# EAGLE schematic edition4-mainpart (1) (EAGLE 9.6.2)
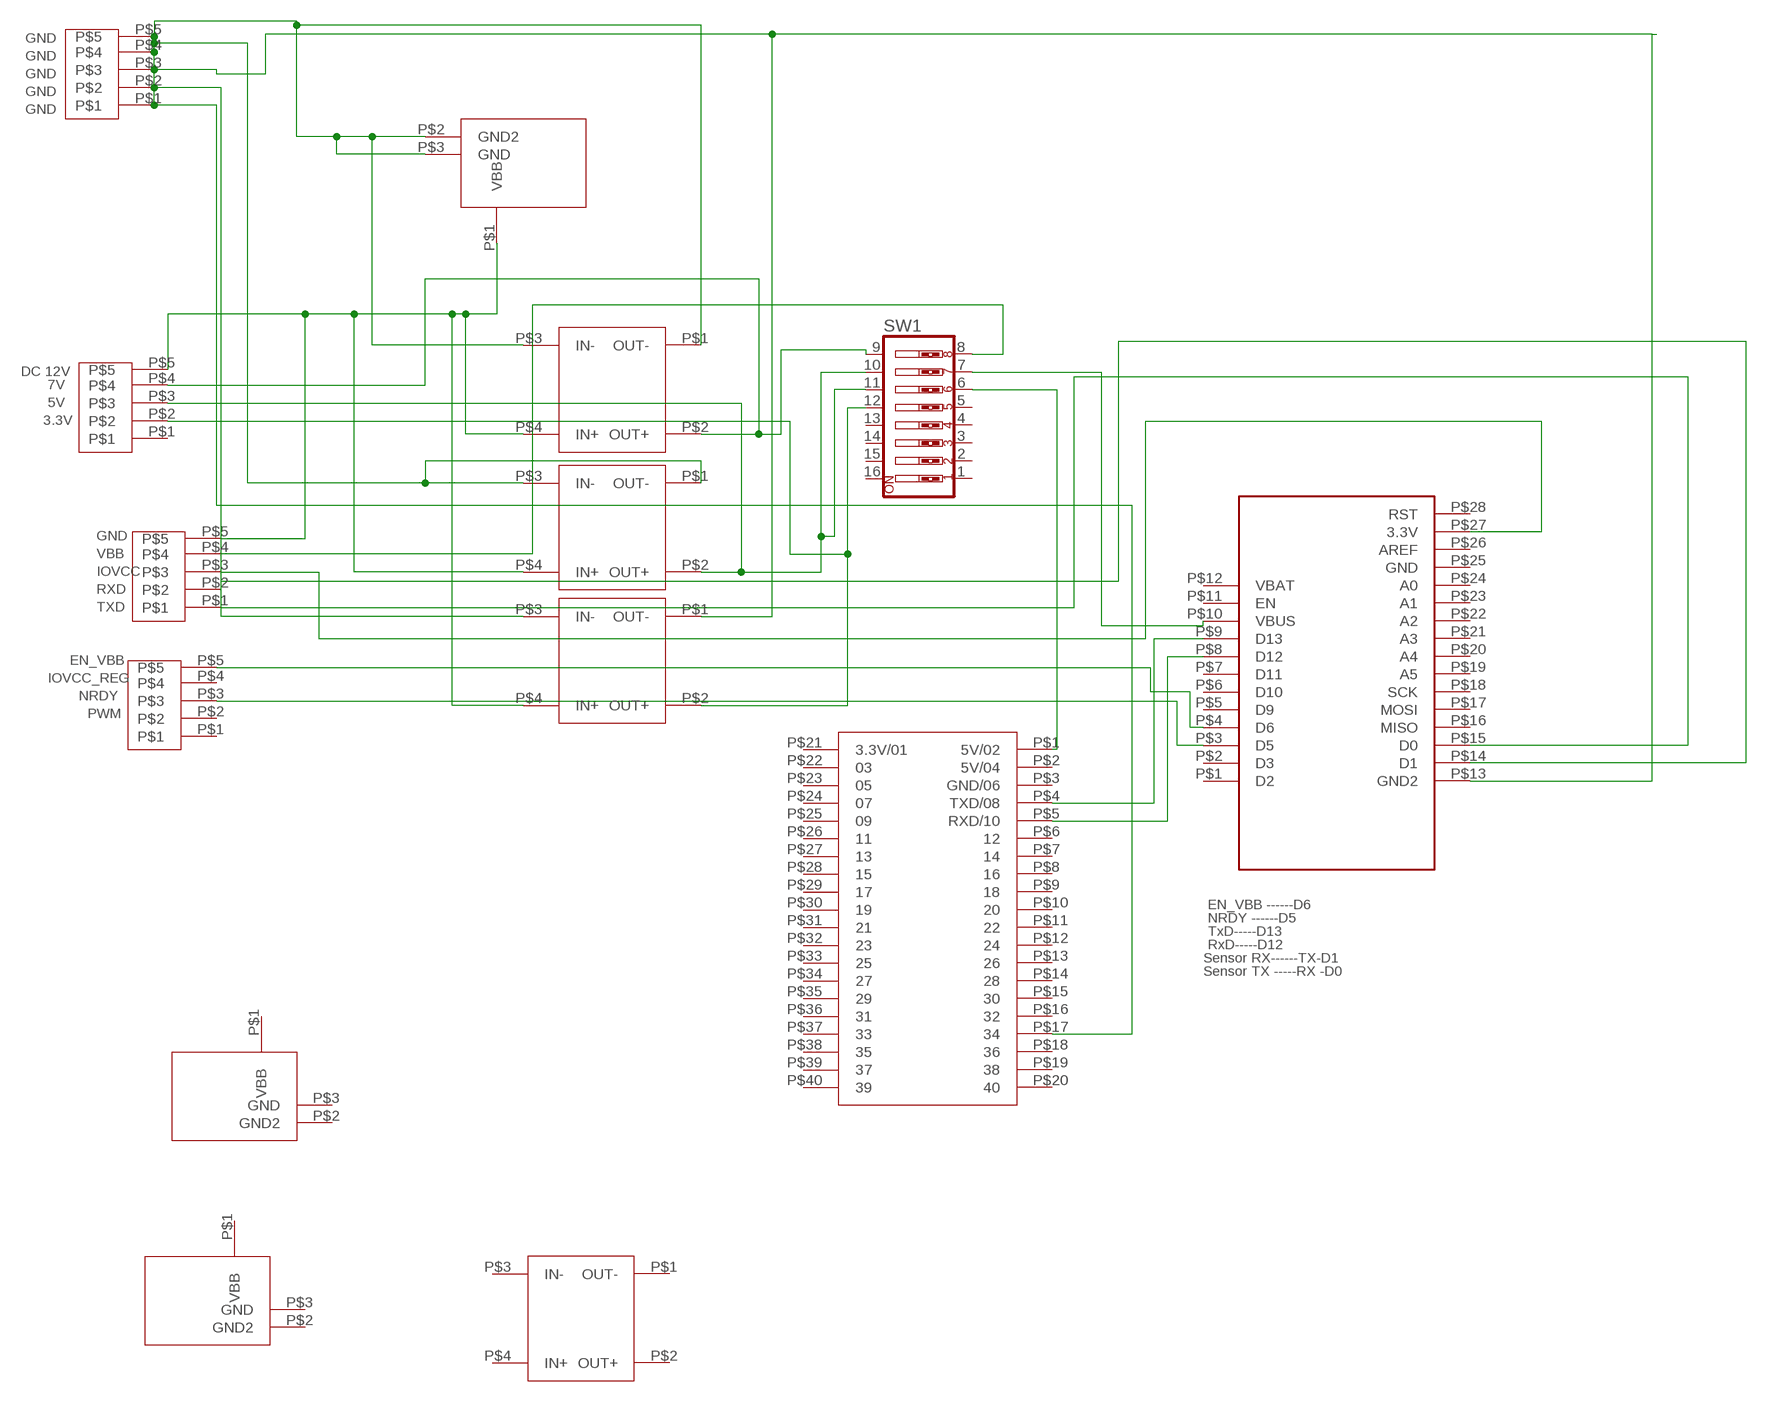
[diagram p0: schematic, sheet 1]

## Parts
SW1  SW_DIP-8  [EDG-08]
U$1  PIN  [PIN]
U$2  PIN  [PIN]
U$3  POWER  [POWERIN]
U$4  POWER  [POWERIN]
U$5  POWER  [POWERIN]
U$6  MH-MINI-360  [MH-MINI-360]
U$7  MH-MINI-360  [MH-MINI-360]
U$8  MH-MINI-360  [MH-MINI-360]
U$9  MH-MINI-360  [MH-MINI-360]
U$10  FEATHER  [FEATHER]
U$11  RASPBERRYPI  [RASPBERRYPI]
U$12  PIN  [PIN]
U$13  PIN  [PIN]

## Nets
N$1: U$3.P$2(GND2) U$3.P$3(GND) U$6.P$1(OUT-) U$6.P$3(IN-) U$8.P$1(OUT-) U$8.P$3(IN-) U$9.P$1(OUT-) U$9.P$3(IN-) U$10.P$13(GND2) U$11.P$17 U$13.P$1 U$13.P$2 U$13.P$3 U$13.P$4 U$13.P$5
N$2: SW1.7 U$10.P$10(VBUS)
N$3: SW1.9 U$6.P$2(OUT+) U$12.P$4
N$4: SW1.6 U$11.P$1(5V/02)
N$5: SW1.8 U$1.P$4
N$6: U$1.P$3 U$10.P$27(3.3V)
N$7: SW1.10 SW1.11 U$9.P$2(OUT+) U$12.P$3
N$8: U$1.P$2 U$10.P$14(D1)
N$9: U$1.P$1 U$10.P$15(D0)
N$10: U$2.P$5 U$10.P$4(D6)
N$11: U$2.P$3 U$10.P$3(D5)
N$12: U$10.P$9(D13) U$11.P$4(TXD/08)
N$14: U$10.P$8(D12) U$11.P$5(RXD/10)
N$15: U$1.P$5 U$3.P$1(VBB) U$6.P$4(IN+) U$8.P$4(IN+) U$9.P$4(IN+) U$12.P$5
N$16: SW1.12 U$8.P$2(OUT+) U$12.P$2
Unconnected: SW1.1 SW1.2 SW1.3 SW1.4 SW1.5 SW1.13 SW1.14 SW1.15 SW1.16 U$2.P$1 U$2.P$2 U$2.P$4 U$4.P$1(VBB) U$4.P$2(GND2) U$4.P$3(GND) U$5.P$1(VBB) U$5.P$2(GND2) U$5.P$3(GND) U$7.P$1(OUT-) U$7.P$2(OUT+) U$7.P$3(IN-) U$7.P$4(IN+) U$10.P$1(D2) U$10.P$2(D3) U$10.P$5(D9) U$10.P$6(D10) U$10.P$7(D11) U$10.P$11(EN) U$10.P$12(VBAT) U$10.P$16(MISO) U$10.P$17(MOSI) U$10.P$18(SCK) U$10.P$19(A5) U$10.P$20(A4) U$10.P$21(A3) U$10.P$22(A2) U$10.P$23(A1) U$10.P$24(A0) U$10.P$25(GND) U$10.P$26(AREF) U$10.P$28(RST) U$11.P$2(5V/04) U$11.P$3(GND/06) U$11.P$6 U$11.P$7 U$11.P$8 U$11.P$9 U$11.P$10 U$11.P$11 U$11.P$12 U$11.P$13 U$11.P$14 U$11.P$15 U$11.P$16 U$11.P$18 U$11.P$19 U$11.P$20 U$11.P$21(3.3V/01) U$11.P$22 U$11.P$23 U$11.P$24 U$11.P$25 U$11.P$26 U$11.P$27 U$11.P$28 U$11.P$29 U$11.P$30 U$11.P$31 U$11.P$32 U$11.P$33 U$11.P$34 U$11.P$35 U$11.P$36 U$11.P$37 U$11.P$38 U$11.P$39 U$11.P$40 U$12.P$1

## Notes on the sheet
- GND
- GND
- GND
- GND
- GND
- DC 12V
- 7V
- 5V
- 3.3V
- GND
- VBB
- IOVCC
- RXD
- TXD
- EN_VBB
- IOVCC_REG
- NRDY
- PWM
- EN_VBB ------D6
- NRDY ------D5
- TxD-----D13
- RxD-----D12
- Sensor RX------TX-D1
- Sensor TX -----RX -D0

## Library data of the parts
SW1 = special:SW_DIP-8: DIP SWITCH
U$1 U$2 U$12 U$13 = untitled:PIN
U$3-U$5 = untitled:POWER
U$6-U$9 = untitled:MH-MINI-360
U$10 = untitled:FEATHER
U$11 = untitled:RASPBERRYPI